# Altium schematic sheet PowerInput.SchDoc
size 393 x 279 mm; DrawnBy: Gustav Eckerbom; SheetNumber: 6; SheetTotal: 6; Project: alife7-genx320cam; Sheet Name: PowerInput; Sheet Size: A3; Project revision: Rev 1
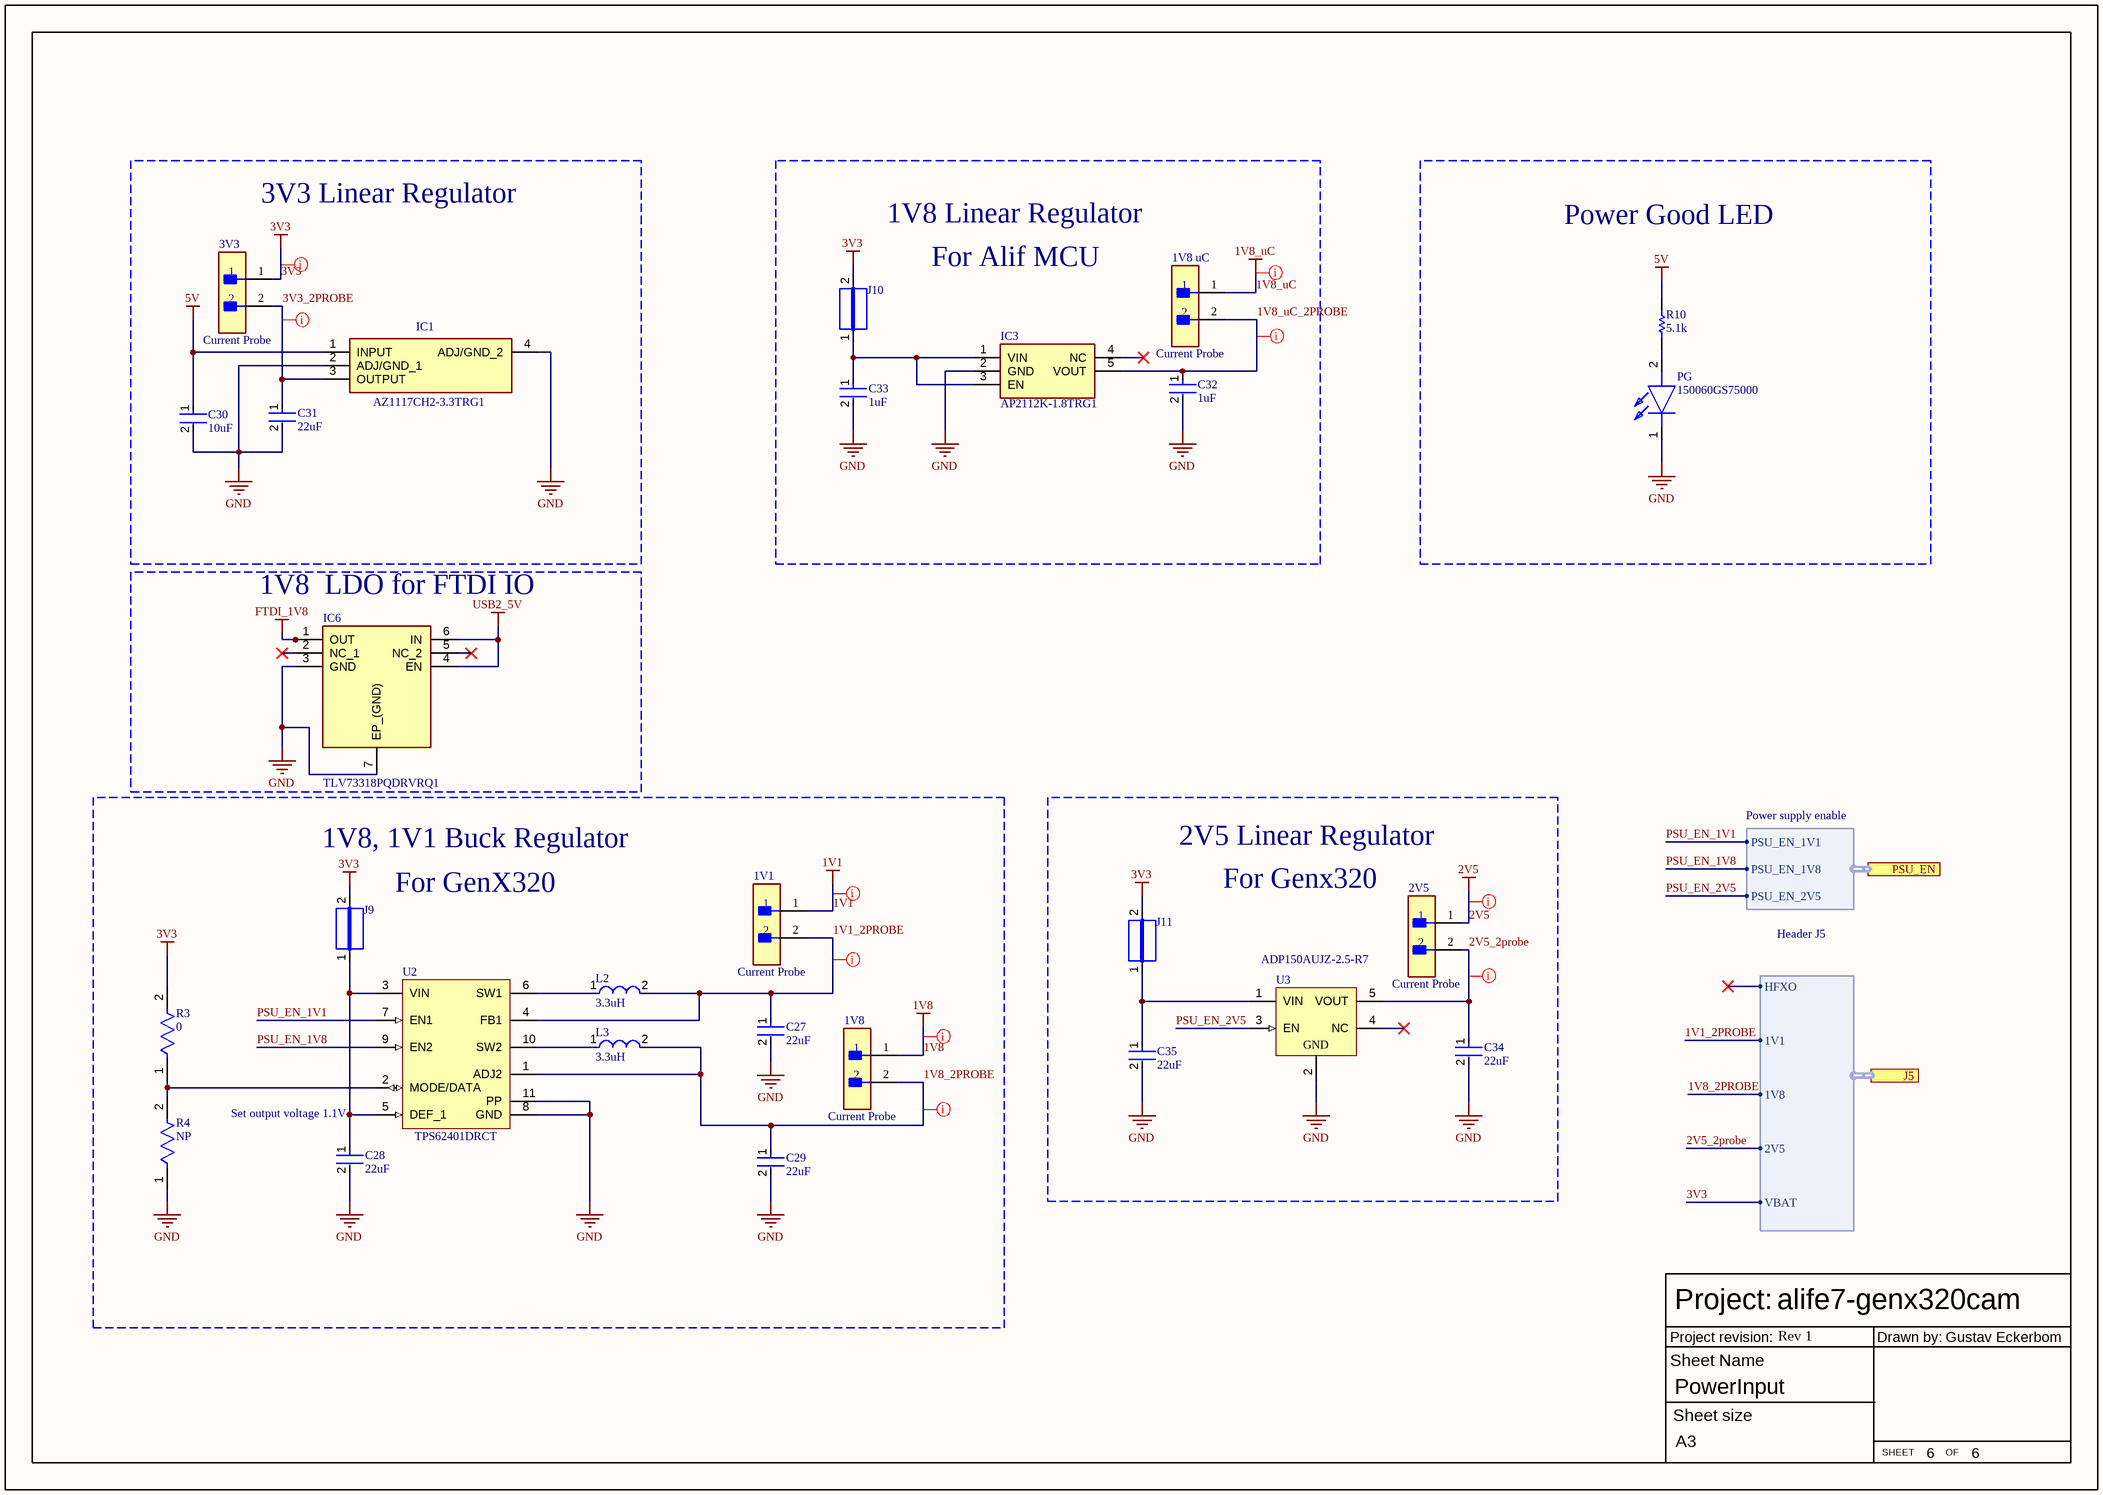
[diagram p0: PowerInput.SchDoc]

## Parts
1V1  Current Probe  [FP-4-103185-0-02-MFG]
1V8  Current Probe  [FP-4-103185-0-02-MFG]
1V8_uC  Current Probe  [FP-4-103185-0-02-MFG]
2V5  Current Probe  [FP-4-103185-0-02-MFG]
3V3  Current Probe  [FP-4-103185-0-02-MFG]
C27  22uF  [FP-1206-L_3_2_0_2-W_1_6_0-IPC_C]
C28  22uF  [FP-1206-L_3_2_0_2-W_1_6_0-IPC_C]
C29  22uF  [FP-1206-L_3_2_0_2-W_1_6_0-IPC_C]
C30  10uF  [FP-CC0603-0_15-0_95-IPC_C]
C31  22uF  [FP-1206-L_3_2_0_2-W_1_6_0-IPC_C]
C32  1uF  [FP-CL10-IPC_C]
C33  1uF  [FP-CL10-IPC_C]
C34  22uF  [FP-1206-L_3_2_0_2-W_1_6_0-IPC_C]
C35  22uF  [FP-1206-L_3_2_0_2-W_1_6_0-IPC_C]
IC1  AZ1117CH2-3.3TRG1  [SOT230P700X180-4N]
IC3  AP2112K-1.8TRG1  [SOT95P285X140-5N]
IC6  TLV73318PQDRVRQ1  [SON65P200X200X80-7N]
J9  JUMPER  [JUMPER]  (value not drawn)
J10  JUMPER  [JUMPER]  (value not drawn)
J11  JUMPER  [JUMPER]  (value not drawn)
L2  3.3uH  [FP-LQM21PH_G0-IPC_C]
L3  3.3uH  [FP-LQM21PH_G0-IPC_C]
PG  150060GS75000  [LEDC1608X80N]
R3  0  [FP-RK73Z2A-MFG]
R4  NP  [FP-RK73Z2A-MFG]
R10  5.1k  [RESC0603(1608)_N]
U2  TPS62401DRCT  [DRC0010J_V]
U3  ADP150AUJZ-2.5-R7  [ADI-UJ-5_N]

## Blocks framed on the sheet
3V3 Linear Regulator: 3V3 C30 C31 IC1
Power Good LED: PG R10
1V8  LDO for FTDI IO: IC6

## Ports
J5 (harness Header J5), PSU_EN (harness Power supply enable)

## Harnesses
Power supply enable: PSU_EN_1V1, PSU_EN_1V8, PSU_EN_2V5
Header J5: HFXO, 1V1, 2V5, 1V8, VBAT

## Nets
1V1: 1V1.1
1V8: 1V8.1
1V8_uC: 1V8_uC.1
2V5: 2V5.1
3V3: 3V3.1 J9.2 J10.2 J11.2 R3.2 ; port J5.VBAT
5V: C30.1 IC1.1(INPUT) R10.2
FTDI_1V8: IC6.1(OUT)
GND: C27.2 C28.2 C29.2 C30.2 C31.2 C32.2 C33.2 C34.2 C35.2 IC1.2(ADJ/GND_1) IC1.4(ADJ/GND_2) IC3.2(GND) IC6.3(GND) IC6.7(EP_(GND)) PG.1(K) R4.1 U2.8(GND) U2.11(PP) U3.2(GND)
USB2_5V: IC6.4(EN) IC6.6(IN)
1V1_2PROBE: 1V1.2 C27.1 L2.2 U2.4(FB1) ; port J5.1V1
1V8_2PROBE: 1V8.2 C29.1 L3.2 U2.1(ADJ2) ; port J5.1V8
1V8_uC_2PROBE: 1V8_uC.2 C32.1 IC3.5(VOUT)
2V5_2probe: 2V5.2 C34.1 U3.5(VOUT) ; port J5.2V5
3V3_2PROBE: 3V3.2 C31.1 IC1.3(OUTPUT)
PSU_EN_1V1: U2.7(EN1) ; port PSU_EN.PSU_EN_1V1
PSU_EN_1V8: U2.9(EN2) ; port PSU_EN.PSU_EN_1V8
PSU_EN_2V5: U3.3(EN) ; port PSU_EN.PSU_EN_2V5
NetC28_1: C28.1 J9.1 U2.3(VIN) U2.5(DEF_1)
NetC33_1: C33.1 IC3.1(VIN) IC3.3(EN) J10.1
NetC35_1: C35.1 J11.1 U3.1(VIN)
NetL2_1: L2.1 U2.6(SW1)
NetL3_1: L3.1 U2.10(SW2)
NetPG_2: PG.2(A) R10.1
NetR3_1: R3.1 R4.2 U2.2(MODE/DATA)

Not connected (* = marked no-connect by the designer): IC3 4(NC)*; IC6 2(NC_1)* 5(NC_2)*; U3 4(NC)*

## Layout directives
net class Power: 1V1, 1V1_2PROBE, 1V8, 1V8_2PROBE, 1V8_uC, 1V8_uC_2PROBE, 2V5, 2V5_2probe, 3V3, 3V3_2PROBE

## Notes on the sheet
- 1V8 Linear Regulator
- For Alif MCU
- 1V8, 1V1 Buck Regulator
- (near J9) For GenX320
- 2V5 Linear Regulator
- For Genx320
- Set output voltage 1.1V
- Project:
- Sheet Name
- Project revision:
- Drawn by:
- Sheet size
- SHEET
- OF

## Library data of the parts
1V1 1V8 1V8_uC 2V5 3V3 = CMP-06573-39509931-1: 4-103185-0-02 Conn Header Vert 2POS 2.54MM; Connector Type: Male Pin; Number of Contacts: 2; Gender: Male; Width: 2.34mm; Contact Plating: Gold; Number of Rows: 1; Pitch: 2.54mm; Termination: Solder; Housing Color: Black; Mount: Through Hole; Contact Mating Length: 5.842mm; Housing Material: Plastic; Length: 4.67mm; Number of Positions: 2; Packaging: Bulk; NexarPartId: 39509931; Contact Material: Bronze; Lead Free: Contains Lead; Case/Package: 100; Color: Black; RoHS: Non-Compliant; Height: 2.29mm
C27-C29 C31 C34 C35 = CMP-001-00089-1: Ceramic Capacitor, Multilayer, Ceramic, 6.3V, 20% +Tol, 20% -Tol, X7R, 15% TC, 22uF, Surface Mount, 1206; Value: 22µF; Min Operating Temperature: -55°C; Case/Package: 1206; Max Operating Temperature: 125°C; Capacitor Type: Ceramic; Mounting Technology: Surface Mount; Pins: 2; RoHS Compliant: Yes
C30 = CMP-001-00088-4: Ceramic Capacitor, Multilayer, Ceramic, 6.3V, 10% +Tol, 10% -Tol, X5R, 15% TC, 10uF, Surface Mount, 0603; Value: 10µF; Min Operating Temperature: -55°C; Max Operating Temperature: 85°C; Case/Package: 0603; RoHS Compliant: Yes; Capacitor Type: Ceramic; Mounting Technology: Surface Mount; Pins: 2
C32 C33 = CMP-001-00087-5: Ceramic Capacitor, Multilayer, Ceramic, 10V, 10% +Tol, 10% -Tol, X5R, 15% TC, 1uF, Surface Mount, 0603; Value: 1µF; Min Operating Temperature: -55°C; Max Operating Temperature: 85°C; Case/Package: 0603; Capacitor Type: Ceramic; Mounting Technology: Surface Mount; Pins: 2; RoHS Compliant: Yes
IC1 = AZ1117CH2-3.3TRG1: Integrated Circuit; Manufacturer_Name: Diodes Incorporated; Datasheet Link: https://www.diodes.com//assets/Datasheets/AZ1117C.pdf; Height: 1.8mm; Manufacturer_Part_Number: AZ1117CH2-3.3TRG1; Mouser Part Number: 621-AZ1117CH2-33TRG1; Mouser Price/Stock: https://www.mouser.co.uk/ProductDetail/Diodes-Incorporated/AZ1117CH2-3.3TRG1?qs=lQAVKuKFhkLc7jCxso2G3w%3D%3D; Arrow Part Number: AZ1117CH2-3.3TRG1; Arrow Price/Stock: https://www.arrow.com/en/products/az1117ch2-3.3trg1/diodes-incorporated?utm_currency=USD&region=nac
IC3 = AP2112K-1.8TRG1: Integrated Circuit; Manufacturer_Name: Diodes Incorporated; Datasheet Link: https://www.diodes.com//assets/Datasheets/AP2112.pdf; Height: 1.4mm; Manufacturer_Part_Number: AP2112K-1.8TRG1; Mouser Part Number: 621-AP2112K-1.8TRG1; Mouser Price/Stock: https://www.mouser.co.uk/ProductDetail/Diodes-Incorporated/AP2112K-1.8TRG1?qs=x6A8l6qLYDBx1xhw8AX2cw%3D%3D; Arrow Part Number: AP2112K-1.8TRG1; Arrow Price/Stock: https://www.arrow.com/en/products/ap2112k-1.8trg1/diodes-incorporated?region=nac
IC6 = TLV73318PQDRVRQ1: Integrated Circuit; Manufacturer_Name: Texas Instruments; Datasheet Link: http://www.ti.com/lit/gpn/tlv733p-q1; Height: 0.8mm; Manufacturer_Part_Number: TLV73318PQDRVRQ1; Mouser Part Number: 595-TLV73318PQDRVRQ1; Mouser Price/Stock: https://www.mouser.co.uk/ProductDetail/Texas-Instruments/TLV73318PQDRVRQ1?qs=Euq2YPj5ArJy%2FbA%2Fxu1pyg%3D%3D; Arrow Part Number: TLV73318PQDRVRQ1; Arrow Price/Stock: https://www.arrow.com/en/products/tlv73318pqdrvrq1/texas-instruments
J9-J11 = CMP-009-00061-2: Pins: 2
L2 L3 = CMP-06042-016226-1: Multilayer Type Inductor for Power Lines, 0805 (2012), 3.3μH, 30%, 0.207Ω, 0.8A; Max DC Current: 800mA; Test Frequency: 1MHz; Shielding: Shielded; Core Material: Ferrite; DC Resistance (DCR): 207mR; Self Resonant Frequency: 30MHz; Length: 0.079inch; Series: LQM21PN_G0; Width: 1.25mm; Termination: SMD/SMT; Tolerance: 30%; Case Code (Imperial): 0805; Min Operating Temperature: -55°C; Inductance: 3.3uH; Current Rating: 800mA; Mount: Surface Mount; Packaging: Tape and Reel; RoHS Compliant: Yes; Height - Seated (Max): 0.039inch; Package Quantity: 4000; Case/Package: 0805; Height: 0.9mm; Max Operating Temperature: 125°C; Case Code (Metric): 2012
PG = 150060GS75000: LED; Manufacturer_Name: Wurth Elektronik; Datasheet Link: https://componentsearchengine.com/Datasheets/2/150060GS75000.pdf; Height: 0.8mm; Manufacturer_Part_Number: 150060GS75000; Mouser Part Number: 710-150060GS75000; Mouser Price/Stock: https://www.mouser.co.uk/ProductDetail/Wurth-Elektronik/150060GS75000?qs=LlUlMxKIyB0UYkq5lDO8nA%3D%3D
R3 R4 = CMP-2000-05462-2: RES 0 OHM JUMPER 0805; Temperature Coefficient: 400ppm/°C; Tolerance: 1%; Resistance: 0mR; Power Rating: 2W; Min Operating Temperature: -55°C; Termination: SMD/SMT; Width: 1.25mm; Series: RK73Z; Lead Free: Lead Free; Case Code (Metric): 2012; Military Standard: Not; Case Code (Imperial): 0805; Packaging: Tape and Reel; Max Operating Temperature: 155°C; Package Quantity: 5000; Height: 0.5mm; RoHS Compliant: Yes; Depth: 1.25mm; Length: 2mm; Resistor Type: Thick Film; Case/Package: 0805; Construction: Rectangular
R10 = CMP-1012-00081-1: 2K 0.1W 5% 0603 (1608 Metric)  SMD; Case-Metric: 1608; Value: 2000.00 Ohm; Case-EIA: 0603; Tolerance: 5 %; Technology: SMT; Power: 0.1 W
U2 = CMP-0323-00299-3: Buck Step Down Regulator with 2.5 to 6 V Input and 1.1 to 1.575 V Output, -40 to 85 degC, 10-Pin SON (DRC), Green (RoHS & no Sb/Br); Manufacturer: Texas Instruments; Vin(Max)(V): 6; Synchronous Rectification: TRUE; Regulated Outputs(#): 2; Iout(Max)(A): 0.4; Duty Cycle(Max)(%): 100; Vout2(Min)(V): 2.8; SubFamily: Step-Down Regulator; Vout(Min)(V): 1.1; Vin(Min)(V): 2.5; Iout2(Max)(A): 0.6; Switch Current Limit(Typ)(A): 1; Rating: Catalog; Iq(Typ)(mA): 0.032; Vout(Max)(V): 1.575; Eco-Plan: Green (RoHS & no Sb/Br); ComponentLink3URL: Samples URL:http://www.ti.com/product/tps62401#samples; Topology: Buck; Vout2(Max)(V): 2.8; ComponentLink1URL: http://www.ti.com/general/docs/lit/getliterature.tsp?genericPartNumber=TPS62401&fileType=pdf; ComponentLink1Description: Datasheet; Dynamic Voltage Scaling: TRUE; ComponentLink2Description: Package Specification; PackageVersion: revL, Sep-2011; ComponentLink3Description: URL Link1; Mounting Technology: Surface Mount; ComponentLink2URL: http://www.ti.com/litv/pdf/mpds117k; PartNumber: TPS62401DRCT; PackageDescription: 10-Pin Plastic Small Outline No-Lead, 3 x 3 x 1 mm Body, 0.5 mm Pitch, Exposed Pad; PackageReference: DRC0010J; DatasheetVersion: SLVS681E
U3 = CMP-0786-00375-1: Ultralow Noise, 150 mA CMOS Linear Regulator, 2.2 to 5.5 V Vin, 2.5 V Vout, Industrial, 5-pin SOT23 (UJ-5), Reel; Manufacturer: Analog Devices; Iout max: 150mA; Preset Vout Values (V): 2.5; Supply Current IGND @ Small Load: 10uA; Vin (max) (V): 5.5; Vin (min) (V): 2.2; ComponentLink1URL: http://www.analog.com/en/index.html; ComponentLink2Description: Datasheet; ComponentLink4URL: Product URL:http://www.analog.com/en/ADP150/productSearch.html; ComponentLink3Description: Package Specification; PackageDescription: 5-Pin Thin Small Outline Transistor Package, Body 2.9 x 1.6 mm, Pitch 0.95 mm; PackageReference: UJ-5; ComponentLink3URL: http:/www.analog.com/static/imported-files/packages/PKG_PDF/TSOT(UJ)/UJ_5.pdf; Packing: Reel; ComponentLink4Description: URL Link1; ComponentLink2URL: http://www.analog.com/static/imported-files/data_sheets/ADP150.pdf; Code_JEDEC: MO-193-AB; DatasheetVersion: Rev. A; PackageVersion: 100708-A, 10/2008; ComponentLink1Description: Manufacturer URL; Mounting Technology: Surface Mount; PartNumber: ADP150AUJZ-2.5-R7